# Altium schematic sheet Hydroponics_Schematic.SchDoc
size 219 x 180 mm; SheetNumber: 1; SheetTotal: 1
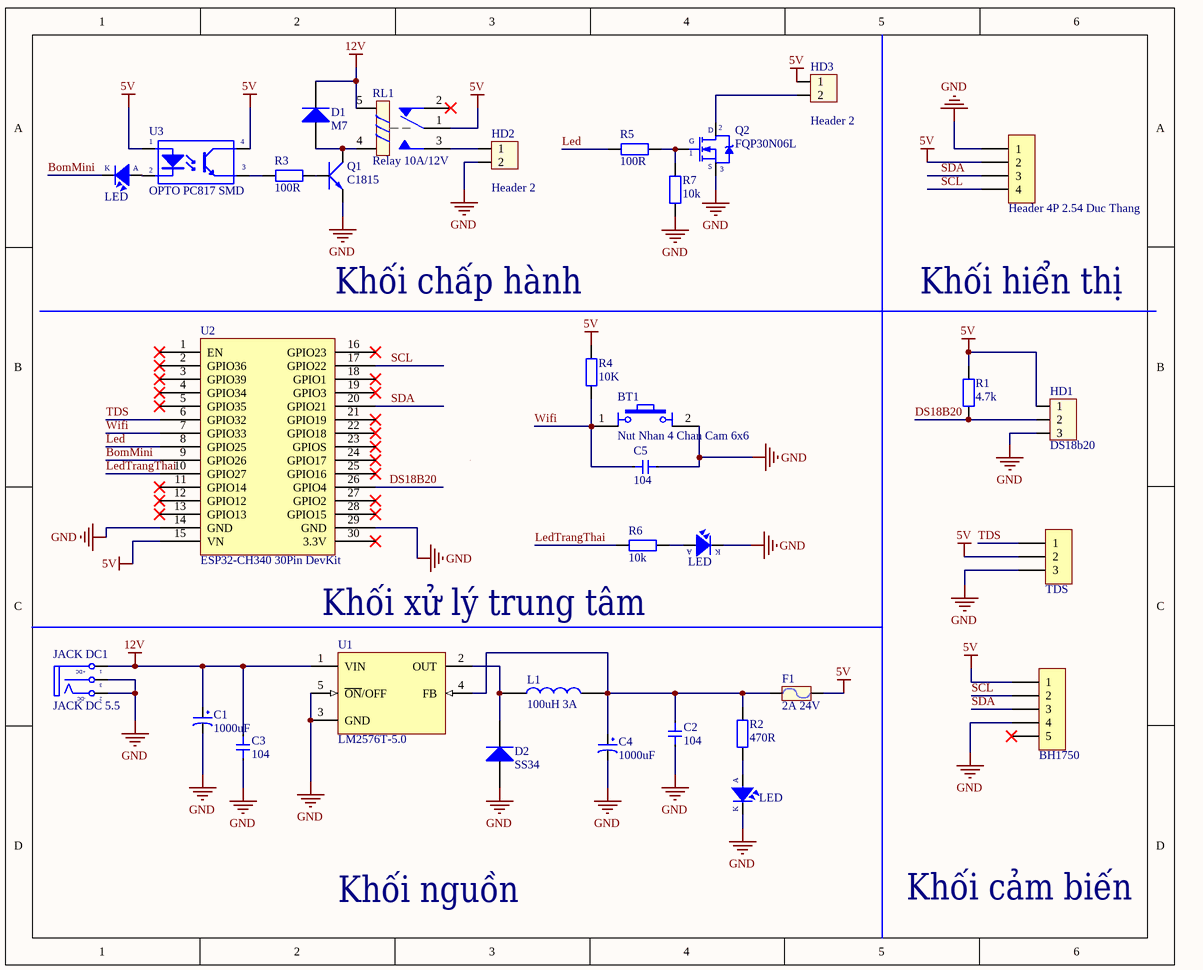
[diagram p0: Hydroponics_Schematic.SchDoc]

## Parts
BT1  Nut Nhan 4 Chan Cam 6x6  [Nut Nhan 4 Chan Cam 6x6]
C1  1000uF  [tu hoa 10mm]
C2  104  [Cap 0805]
C3  104  [Cap 0805]
C4  1000uF  [tu hoa 10mm]
C5  104  [Cap 0805]
D1  M7  [DIODE SMA]
D2  SS34  [DIODE SMA]
F1  2A 24V  [Cau chi tu phuc hoi 2A 24V SMD1812]
H1  BH1750  [XH2.54M-5]
H2  TDS  [XH2.54M-3]
H3  Header 4P 2.54 Duc Thang  [XH2.54M-4]
HD1  DS18b20  [KF127-3P]
HD2  Header 2  [HED2]
HD3  Header 2  [HED2]
JACK_DC1  JACK DC 5.5  [JACK DC 5.5]
L1  100uH 3A  [CUON CAM 100uH3A]
LED1  LED  [LED-3]
LED2  LED  [LED-3]
LED3  LED  [LED-3]
Q1  C1815  [QTO-92]
Q2  FQP30N06L  [QTO-220]
R1  4.7k  [Tro SMD 0805]
R2  470R  [Tro SMD 0805]
R3  100R  [Tro SMD 0805]
R4  10K  [Tro SMD 0805]
R5  100R  [Tro SMD 0805]
R6  10k  [Tro SMD 0805]
R7  10k  [Tro SMD 0805]
RL1  Relay 10A/12V  [RL_SPDT_10A]
U1  LM2576T-5.0  [LM2576t]
U2  ESP32-CH340 30Pin DevKit  [DIP30]
U3  OPTO PC817 SMD  [SOP4]

## Nets
5V: F1.2 H1.1 H2.2 H3.2 HD1.1 HD3.1 R1.1 R4.2 RL1.1 U2.15(VN) U3.1(A) U3.4(C)
12V: C1.1 C3.1 D1.2(K) JACK_DC1.1(T) RL1.5 U1.1(VIN)
GND: BT1.2 C1.2 C2.2 C3.2 C4.2 C5.2 D2.1(A) H1.4 H2.3 H3.1 HD1.3 HD2.2 JACK_DC1.2(TN) JACK_DC1.3(S) LED1.2(K) LED2.2(K) Q1.1(E) Q2.3(S) R7.2 U1.3(GND) U1.5(~{ON}/OFF) U2.14(GND) U2.29(GND)
BomMini: LED3.2(K) U2.9(GPIO26)
DS18B20: HD1.2 R1.2 U2.26(GPIO4)
Led: R5.1 U2.8(GPIO25)
LedTrangThai: R6.2 U2.10(GPIO27)
SCL: H1.2 H3.4 U2.17(GPIO22)
SDA: H1.3 H3.3 U2.20(GPIO21)
TDS: H2.1 U2.6(GPIO32)
Wifi: BT1.1 C5.1 R4.1 U2.7(GPIO33)
NetC2_1: C2.1 C4.1 F1.1 L1.2 R2.2 U1.4(FB)
NetD1_1: D1.1(A) Q1.2(C) RL1.4
NetD2_2: D2.2(K) L1.1 U1.2(OUT)
NetHD2_1: HD2.1 RL1.3
NetHD3_2: HD3.2 Q2.2(D)
NetLED1_1: LED1.1(A) R2.1
NetLED2_1: LED2.1(A) R6.1
NetLED3_1: LED3.1(A) U3.2(K)
NetQ1_3: Q1.3(B) R3.2
NetQ2_1: Q2.1(G) R5.2 R7.1
NetR3_1: R3.1 U3.3(E)

Not connected (* = marked no-connect by the designer): H1 5*; RL1 2*; U2 1(EN)* 2(GPIO36)* 3(GPIO39)* 4(GPIO34)* 5(GPIO35)* 11(GPIO14)* 12(GPIO12)* 13(GPIO13)* 16(GPIO23)* 18(GPIO1)* 19(GPIO3)* 21(GPIO19)* 22(GPIO18)* 23(GPIOS)* 24(GPIO17)* 25(GPIO16)* 27(GPIO2)* 28(GPIO15)* 30(3.3V)*

## Notes on the sheet
- Khối chấp hành
- Khối hiển thị
- Khối xử lý trung tâm
- Khối nguồn
- Khối cảm biến
- (in symbol JACK DC 5.5) +DC; -DC

## Library data of the parts
BT1 = Nut Nhan 4 Chan Cam 6x6: Nut Nhan 4 Chan 6x6mm; Ten: Nút Nhấn 4 Chân 6x6x5MM DIP; Ma_Hang: MH004584
C1 C4 = Tu Hoa 1000uF 10V 10x12: Cắm; So_Chan: 2; Don_Vi: Con; Ten_Linh_Kien: Tụ Hóa 1000uF 10V 10x12MM; Ma_Hang: MH006614; Kieu_Chan: *; Chung_Loai: Cắm
C2 C3 C5 = Cap 0805: Capacitor SMD 0805
D1 = Diode M7 ( 4007 ): Dán; Don_Vi: Con; Ten_Linh_Kien: Diode M7 1N4007 SMD 1A 1000V; Ma_Hang: MH000944; Chung_Loai: Dán; Ghi_Chu: *
D2 = Diode SS34 ( 1N5822 ): Dán; Don_Vi: Con; Ma_Hang: MH002104; Ten_Linh_Kien: Diode SS34 3A 40V SMA ( 1N5822 SS34A); Kieu_Chan: *; Chung_Loai: Dán
F1 = Cau chi tu phuc hoi 2A 24V SMD1812: 2A 24V SMD1812; Ma_Hang: MH010033; Ten: Cầu Chì Tự Phục Hồi 2A 24V SMD1812
H1 = Header 5P 2.54 Duc Thang: Cắm; Ten_Linh_Kien: Header 5P XH2.54-5P Đực Thẳng; Don_Vi: Con; Ma_Hang: MH001298; Chung_Loai: Cắm
H2 = Header 3P 2.54 Duc Thang: Cắm; Ten_Linh_Kien: Header 3P XH2.54-3P Đực Thẳng; Don_Vi: Con; Ma_Hang: MH001292; Chung_Loai: Cắm
H3 = Header 4P 2.54 Duc Thang: Cắm; Ten_Linh_Kien: Header 4P XH2.54-4P Đực Thẳng; Don_Vi: Con; Ma_Hang: MH001285; Chung_Loai: Cắm
HD1 = Hed3: Header 3 (Green); Value: Header 3
HD2 HD3 = Hed2: Header 2 (Green); Value: Header 2
JACK_DC1 = JACK DC 5.5: Value: Jac DC
L1 = CUON CAM 100uH DIP: Dán; Don_Vi: Con; Ma_Hang: MH002209; Ten_Linh_Kien: Cuộn Cảm 100uH 3A 8x10MM; Chung_Loai: Dán; Ghi Chu: *; Kieu Chan: *
LED1-LED3 = LED: LED Single colour Green and Red; Value: LED 3 ly Single Colour
Q1 = C1815: NPN 600mW, ECB; Value: C1815
Q2 = IRF840: MOSFET N - CHANNEL 500V - 0.75 - 8A - TO-220; Value: IRF840
R1-R7 = Tro 0805 5% 470R: Dán; Don_Vi: Con; Ma_Hang: MH005341; Ten_Linh_Kien: Trở 0805 5% 470R; So_Chan: 2; Chung_Loai: Dán; Kieu_Chan: *
RL1 = Relay 1: Relay SPDT,10A - 12VDC 5 Pin; Value: Relay SPDT, 10A, 12V
U1 = LM2576T-5.0: SIMPLE SWITCHER; 3A Step-Down Voltage Regulator; Manufacturer: National Semiconductor; PackageTopMarking: NSUZXYTT*LM2576T*-5.0 P+; PowerWise: N; FirstPublished: 4-Dec-2008; DatasheetVersion: Aug-2004; PackageVersion: revJ, Jan-1992; PackageReference: T05A; Publisher: Altium Limited; PackageDescription: TO-220, Molded, 5 Lead, Straight; CompType: Switcher; PartNumber: LM2576T-5.0; RoHS: O; PinCount: 5; DigiKeyPartNumber: LM2576T-5.0-ND; Code_JEDEC: TO-220-AB; ComponentLink1Description: LM2576 Datasheet; ComponentLink1URL: http://www.national.com/ds/LM/LM2576.pdf; ComponentLink2Description: LM2576 Web Page; ComponentLink2URL: http://www.national.com/pf/LM/LM2576.html; ComponentLink3Description: T05A Package Page; ComponentLink3URL: http://www.national.com/packaging/folders/t05a.html
U2 = Component_1: ESP32 DevKit V1 (CH340, 30 pins, 3.3V)
U3 = OPTO PC817 SMD: Single Opto; Value: PC817